# Altium project Design2.PrjPcb
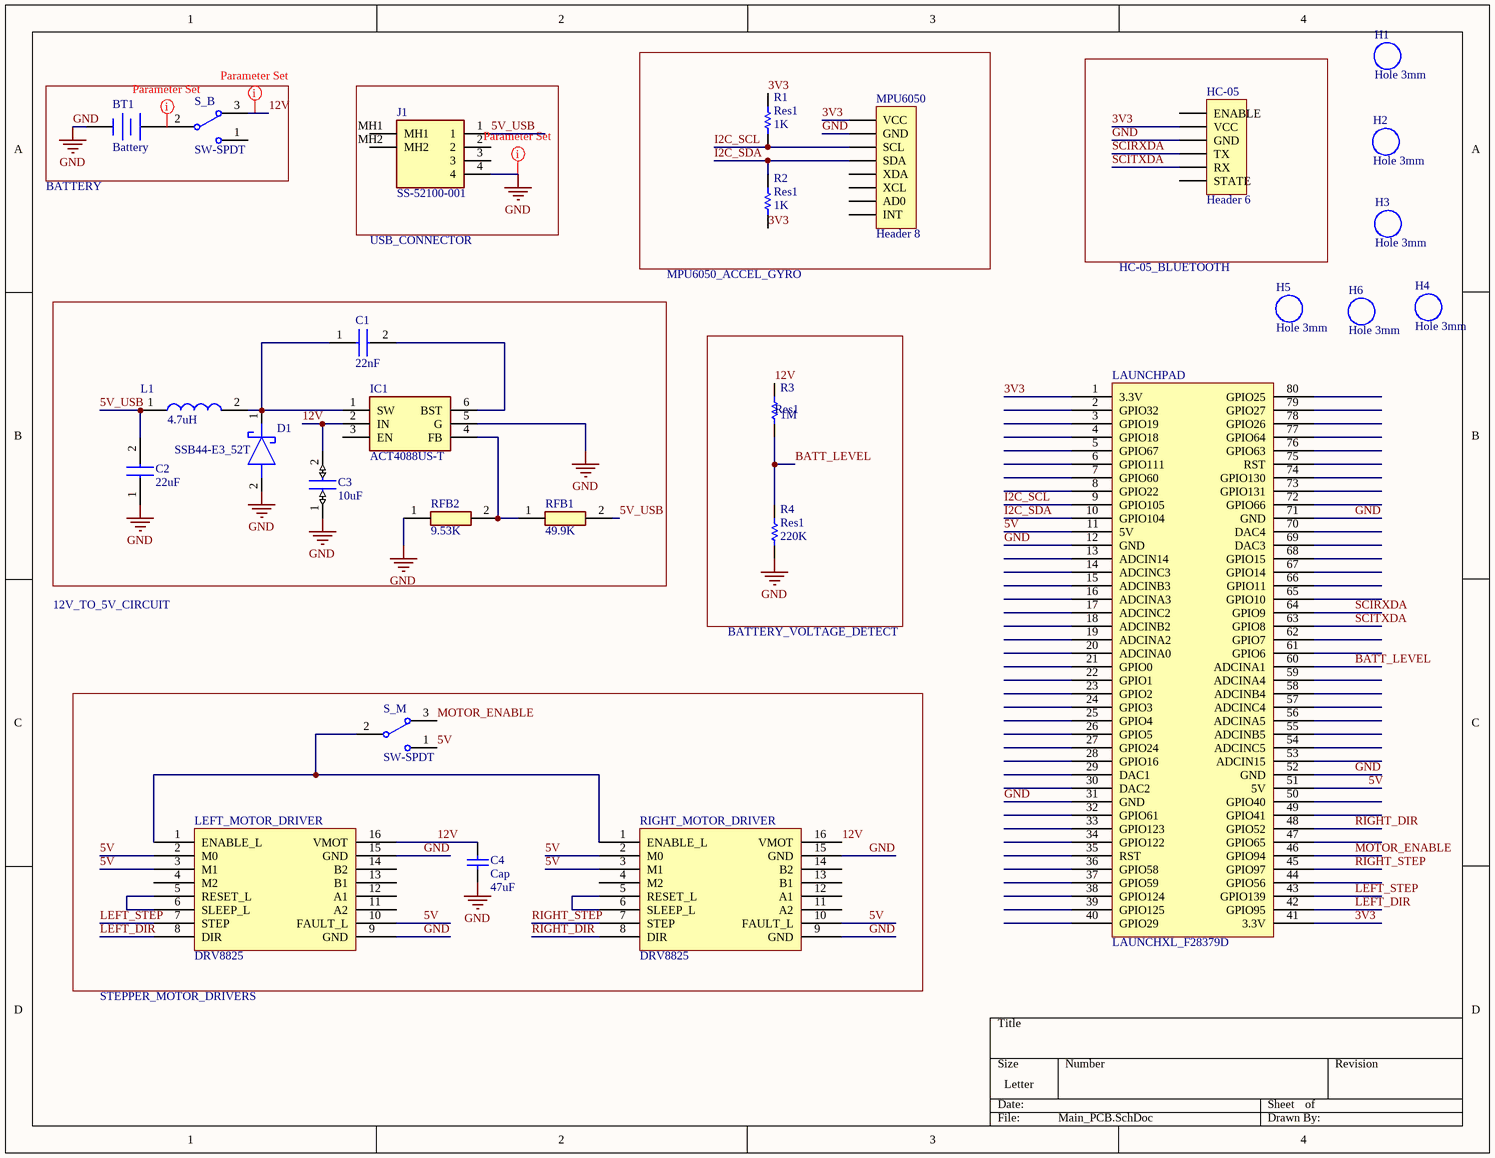
[diagram p0: Main_PCB.SchDoc]
1 sheet, 28 parts. Net scope: global (net labels, ports and power ports of the same name join across sheets).
Board files: PCB1.PcbDoc, PCB2.PcbDoc

## Sheet Main_PCB.SchDoc
size Letter

### Parts
BT1  Battery  [BATT_FP]
C1  22nF  [CAPC2012X135N]
C2  22uF  [CAPC2012X140N]
C3  10uF  [CAPC2114X145N]
C4  Cap  value 47uF  [RAD-0.3]
D1  SSB44-E3_52T  [DIOM5436X244N]
H1  Hole 3mm  [Hole 3mm]
H2  Hole 3mm  [Hole 3mm]
H3  Hole 3mm  [Hole 3mm]
H4  Hole 3mm  [Hole 3mm]
H5  Hole 3mm  [Hole 3mm]
H6  Hole 3mm  [Hole 3mm]
HC-05  Header 6  [HDR1X6]
IC1  ACT4088US-T  [SOT95P280X145-6N]
J1  SS-52100-001  [SS52100001]
L1  4.7uH  [INDC2520X120N]
LAUNCHPAD  LAUNCHXL_F28379D  [LAUNCH_PAD]
LEFT_MOTOR_DRIVER  DRV8825  [DRV8825_FP]
MPU6050  Header 8  [HDR1X8]
R1  Res1  value 1K  [AXIAL-0.3]
R2  Res1  value 1K  [AXIAL-0.3]
R3  Res1  value 1M  [AXIAL-0.3]
R4  Res1  value 220K  [AXIAL-0.3]
RFB1  49.9K  [RESC2012X50N]
RFB2  9.53K  [RESC2012X50N]
RIGHT_MOTOR_DRIVER  DRV8825  [DRV8825_FP]
S_B  SW-SPDT  [SPDT_LARGE]
S_M  SW-SPDT  [SW DPST jameco]

### Nets
GND: BT1.2(-) C2.1(C1) C3.1 C4.1 D1.2(A) HC-05.3(GND) IC1.5(G) J1.4 LAUNCHPAD.12(GND) LAUNCHPAD.31(GND) LAUNCHPAD.52(GND) LAUNCHPAD.71(GND) LEFT_MOTOR_DRIVER.9(GND) LEFT_MOTOR_DRIVER.15(GND) MPU6050.2(GND) R4.1 RFB2.1 RIGHT_MOTOR_DRIVER.9(GND) RIGHT_MOTOR_DRIVER.15(GND)
3V3: HC-05.2(VCC) LAUNCHPAD.1(3.3V) LAUNCHPAD.41(3.3V) MPU6050.1(VCC) R1.2 R2.1
5V: LAUNCHPAD.11(5V) LAUNCHPAD.51(5V) LEFT_MOTOR_DRIVER.2(M0) LEFT_MOTOR_DRIVER.3(M1) LEFT_MOTOR_DRIVER.10(FAULT_L) RIGHT_MOTOR_DRIVER.2(M0) RIGHT_MOTOR_DRIVER.3(M1) RIGHT_MOTOR_DRIVER.10(FAULT_L) S_M.1
5V_USB: C2.2(C2) J1.1 L1.1 RFB1.2
12V: C3.2 C4.2 IC1.2(IN) LEFT_MOTOR_DRIVER.16(VMOT) R3.2 RIGHT_MOTOR_DRIVER.16(VMOT) S_B.3
BATT_LEVEL: LAUNCHPAD.60(ADCINA1) R3.1 R4.2
I2C_SCL: LAUNCHPAD.9(GPIO105) MPU6050.3(SCL) R1.1
I2C_SDA: LAUNCHPAD.10(GPIO104) MPU6050.4(SDA) R2.2
LEFT_DIR: LAUNCHPAD.42(GPIO95) LEFT_MOTOR_DRIVER.8(DIR)
LEFT_STEP: LAUNCHPAD.43(GPIO139) LEFT_MOTOR_DRIVER.7(STEP)
MOTOR_ENABLE: LAUNCHPAD.46(GPIO94) S_M.3
RIGHT_DIR: LAUNCHPAD.48(GPIO52) RIGHT_MOTOR_DRIVER.8(DIR)
RIGHT_STEP: LAUNCHPAD.45(GPIO97) RIGHT_MOTOR_DRIVER.7(STEP)
SCIRXDA: HC-05.4(TX) LAUNCHPAD.64(GPIO9)
SCITXDA: HC-05.5(RX) LAUNCHPAD.63(GPIO8)
NetBT1_1: BT1.1(+) S_B.2
NetC1_1: C1.1 D1.1(K) IC1.1(SW) L1.2
NetC1_2: C1.2 IC1.6(BST)
NetIC1_4: IC1.4(FB) RFB1.1 RFB2.2
NetLEFT_MOTOR_DRIVER_1: LEFT_MOTOR_DRIVER.1(ENABLE_L) RIGHT_MOTOR_DRIVER.1(ENABLE_L) S_M.2
NetLEFT_MOTOR_DRIVER_5: LEFT_MOTOR_DRIVER.5(RESET_L) LEFT_MOTOR_DRIVER.6(SLEEP_L)
NetRIGHT_MOTOR_DRIVER_5: RIGHT_MOTOR_DRIVER.5(RESET_L) RIGHT_MOTOR_DRIVER.6(SLEEP_L)

Not connected (* = marked no-connect by the designer): HC-05 1(ENABLE) 6(STATE); IC1 3(EN); J1 2 3 MH1 MH2; LAUNCHPAD 2(GPIO32) 3(GPIO19) 4(GPIO18) 5(GPIO67) 6(GPIO111) 7(GPIO60) 8(GPIO22) 13(ADCIN14) 14(ADCINC3) 15(ADCINB3) 16(ADCINA3) 17(ADCINC2) 18(ADCINB2) 19(ADCINA2) 20(ADCINA0) 21(GPIO0) 22(GPIO1) 23(GPIO2) 24(GPIO3) 25(GPIO4) 26(GPIO5) 27(GPIO24) 28(GPIO16) 29(DAC1) 30(DAC2) 32(GPIO61) 33(GPIO123) 34(GPIO122) 35(RST) 36(GPIO58) 37(GPIO59) 38(GPIO124) 39(GPIO125) 40(GPIO29) 44(GPIO56) 47(GPIO65) 49(GPIO41) 50(GPIO40) 53(ADCIN15) 54(ADCINC5) 55(ADCINB5) 56(ADCINA5) 57(ADCINC4) 58(ADCINB4) 59(ADCINA4) 61(GPIO6) 62(GPIO7) 65(GPIO10) 66(GPIO11) 67(GPIO14) 68(GPIO15) 69(DAC3) 70(DAC4) 72(GPIO66) 73(GPIO131) 74(GPIO130) 75(RST) 76(GPIO63) 77(GPIO64) 78(GPIO26) 79(GPIO27) 80(GPIO25); LEFT_MOTOR_DRIVER 4(M2) 11(A2) 12(A1) 13(B1) 14(B2); MPU6050 5(XDA) 6(XCL) 7(AD0) 8(INT); RIGHT_MOTOR_DRIVER 4(M2) 11(A2) 12(A1) 13(B1) 14(B2); S_B 1

### Layout directives
rule Width Constraint [Pref Width = 50mil    Min Width = 50mil    Max Width = 50mil]: NetBT1_1
rule Width Constraint [Pref Width = 30mil    Min Width = 30mil    Max Width = 50mil]: 12V, GND

### Notes on the sheet
- BATTERY
- USB_CONNECTOR
- MPU6050_ACCEL_GYRO
- HC-05_BLUETOOTH
- 12V_TO_5V_CIRCUIT
- BATTERY_VOLTAGE_DETECT
- STEPPER_MOTOR_DRIVERS

### Library data of the parts
BT1 = Battery: Multicell Battery; Published: 24-Mar-1999; LatestRevisionDate: 17-Jul-2002; LatestRevisionNote: Re-released for DXP Platform.; PackageReference: BAT-2; Publisher: Altium Limited; PackageDescription: Battery; 2 Leads
C1 = VJ0805Y223JXAPW1BC: Capacitor; Manufacturer_Name: Vishay; Datasheet Link: https://componentsearchengine.com/Datasheets/1/VJ0805Y223JXAPW1BC.pdf; Height: 1.35mm; Manufacturer_Part_Number: VJ0805Y223JXAPW1BC
C2 = 08056D226MAT2A: Capacitor; Manufacturer_Name: AVX; Datasheet Link: http://componentsearchengine.com/Datasheets/3/08056D226MAT2A.pdf; Manufacturer_Part_Number: 08056D226MAT2A
C3 = TMK212BC6106KG-T: Capacitor; Manufacturer_Name: TAIYO YUDEN; Datasheet Link: https://ds.yuden.co.jp/TYCOMPAS/ut/download?pn=LMK063BBJ474MPLF&fileType=CA; Height: 1.45mm; Manufacturer_Part_Number: TMK212BC6106KG-T
C4 = Cap: Capacitor; Published: 8-Jun-2000; LatestRevisionDate: 17-Jul-2002; LatestRevisionNote: Re-released for DXP Platform.; PackageReference: RAD-0.3; Publisher: Altium Limited; PackageDescription: Radial Cap, Thru-Hole; 2 Leads; 0.3 in Pin Spacing
D1 = SSB44-E3_52T: Schottky Diode; Manufacturer_Name: Vishay; Manufacturer_Part_Number: SSB44-E3/52T; Datasheet Link: https://componentsearchengine.com//SSB44-E3_52T.pdf; Height: 2.44mm; Mouser2 Part Number: 625-SSB44-E3; Mouser2 Price/Stock: https://www.mouser.com/Search/Refine.aspx?Keyword=625-SSB44-E3
HC-05 = Header 6: Header, 6-Pin; LatestRevisionDate: 17-Jul-2002; LatestRevisionNote: Re-released for DXP Platform.; Publisher: Altium Limited
IC1 = ACT4088US-T: Integrated Circuit; Manufacturer_Name: Qorvo; Datasheet Link: https://active-semi.com/wp-content/uploads/ACT4088_Datasheet.pdf; Height: 1.45mm; Manufacturer_Part_Number: ACT4088US-T; Mouser Part Number: 107-ACT4088US-T; Mouser Price/Stock: https://www.mouser.co.uk/ProductDetail/Qorvo/ACT4088US-T?qs=QQJxVsr8EGZznLQLhk8tEQ%3D%3D
J1 = SS-52100-001: Connector; Manufacturer_Name: Bel; Height: 7.9mm; Manufacturer_Part_Number: SS-52100-001
L1 = TFM252012ALVA4R7MTAA: Inductor; Manufacturer_Name: TDK; Datasheet Link: https://www.mouser.hk/datasheet/2/400/TDK_02062019_TFM-ALVA_datasheet-1530462.pdf; Height: 1.2mm; Manufacturer_Part_Number: TFM252012ALVA4R7MTAA
LAUNCHPAD = LAUNCHXL_F28379D: pin to pad: 11>21 12>22 13>23 14>24 15>25 16>26 17>27 18>28 19>29 20>30 21>40 22>39 23>38 24>37 25>36 26>35 27>34 28>33 29>32 30>31 31>20 32>19 33>18 34>17 35>16 36>15 37>14 38>13 39>12 40>11 51>61 52>62 53>63 54>64 55>65 56>66 57>67 58>68 59>69 60>70 61>80 62>79 63>78 64>77 65>76 66>75 67>74 68>73 69>72 70>71 71>60 72>59 73>58 74>57 75>56 76>55 77>54 78>53 79>52 80>51
MPU6050 = Header 8: Header, 8-Pin; LatestRevisionDate: 17-Jul-2002; LatestRevisionNote: Re-released for DXP Platform.; Publisher: Altium Limited
R1-R4 = Res1: Resistor; Published: 8-Jun-2000; LatestRevisionDate: 17-Jul-2002; LatestRevisionNote: Re-released for DXP Platform.; PackageReference: AXIAL-0.3; Publisher: Altium Limited; PackageDescription: Axial Device, Thru-Hole; 2 Leads; 0.3 in Pin Spacing
RFB1 = CRCW080549K9FKEA: Resistor; Manufacturer_Name: Vishay; Datasheet Link: http://www.vishay.com/docs/20035/dcrcwe3.pdf; Height: 0.5mm; Manufacturer_Part_Number: CRCW080549K9FKEA
RFB2 = CRCW08059K53FKEA: Resistor; Manufacturer_Name: Vishay; Datasheet Link: https://componentsearchengine.com//CRCW08059K53FKEA.pdf; Height: 0.5mm; Mouser2 Part Number: 71-CRCW0805-9.53K-E3; Mouser2 Price/Stock: https://www.mouser.com/Search/Refine.aspx?Keyword=71-CRCW0805-9.53K-E3; Manufacturer_Part_Number: CRCW08059K53FKEA
S_B S_M = SW-SPDT: SPDT Subminiature Toggle Switch, Right Angle Mounting, Vertical Actuation; Published: 24-Mar-1999; LatestRevisionDate: 17-Dec-2003; LatestRevisionNote: Schematic revised, PCB Footprint replaced.; DatasheetVersion: 05-Dec-2000; PackageReference: TL36WW15050; Publisher: Altium Limited; PackageDescription: Switch; 4 Leads; ComponentLink1Description: Manufacturer Link; ComponentLink1URL: http://www.apem.com